# Altium schematic sheet FPGA_USB.SchDoc
size A3; SheetNumber: 7; SheetTotal: 9
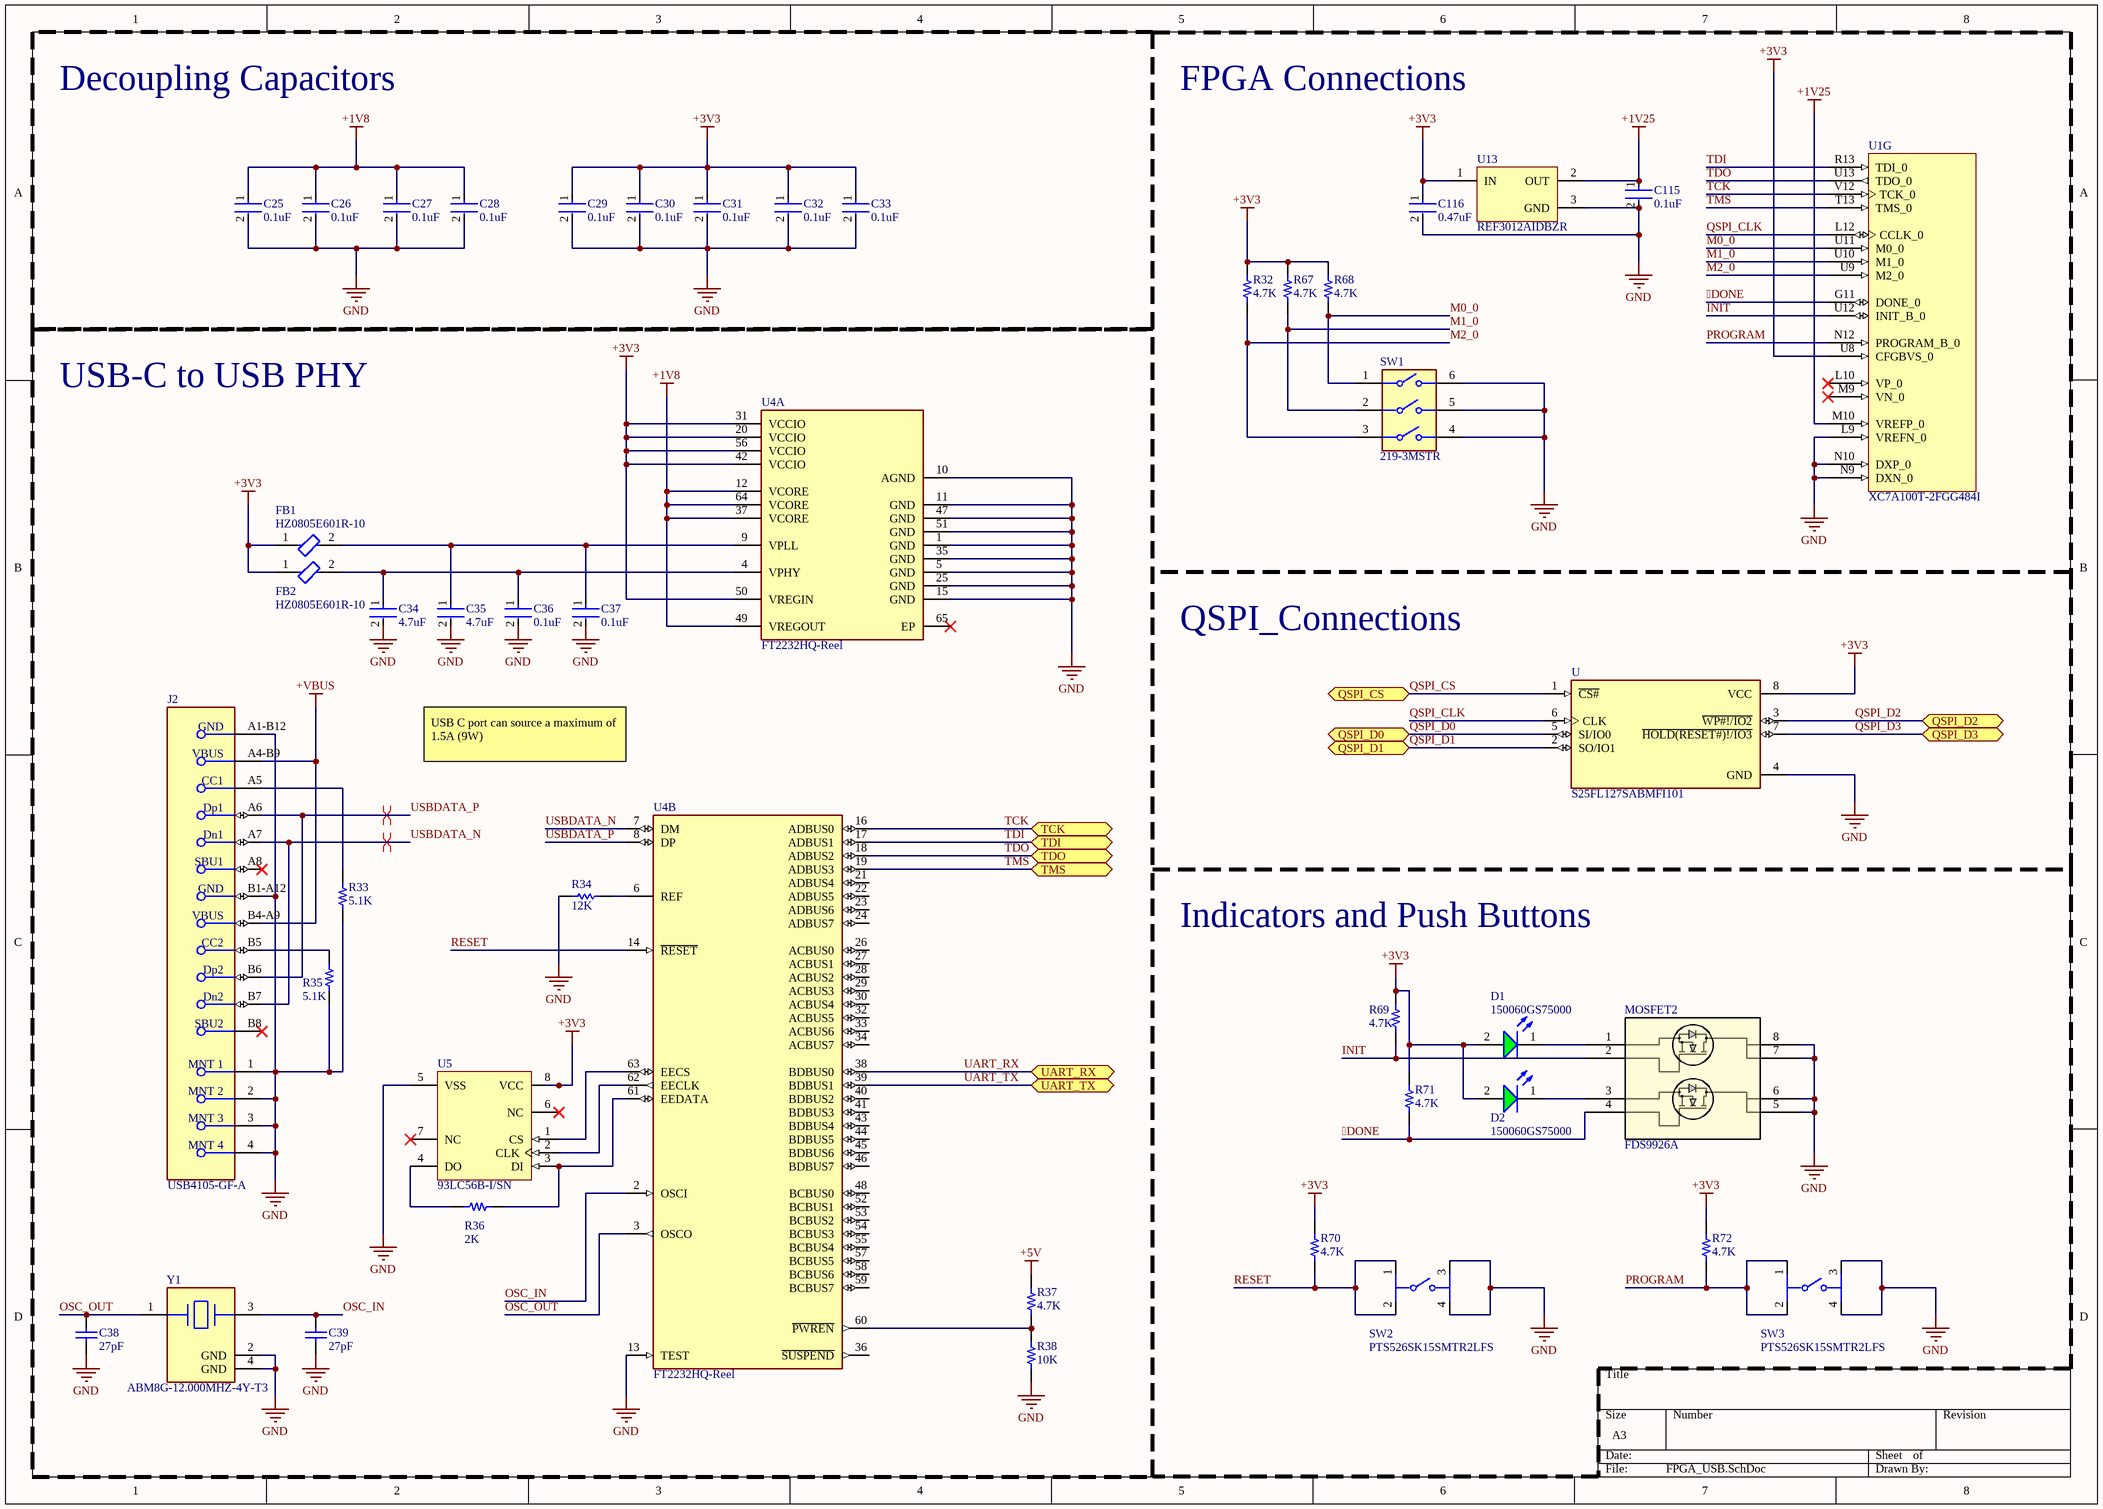
[diagram p0: FPGA_USB.SchDoc]

## Parts
C25  0.1uF  [FP-CC0402-MFG]
C26  0.1uF  [FP-CC0402-MFG]
C27  0.1uF  [FP-CC0402-MFG]
C28  0.1uF  [FP-CC0402-MFG]
C29  0.1uF  [FP-CC0402-MFG]
C30  0.1uF  [FP-CC0402-MFG]
C31  0.1uF  [FP-CC0402-MFG]
C32  0.1uF  [FP-CC0402-MFG]
C33  0.1uF  [FP-CC0402-MFG]
C34  4.7uF  [FP-CC0402-MFG]
C35  4.7uF  [FP-CC0402-MFG]
C36  0.1uF  [FP-CC0402-MFG]
C37  0.1uF  [FP-CC0402-MFG]
C38  27pF  [CAPC1005X55X25LL05T10]
C39  27pF  [CAPC1005X55X25LL05T10]
C115  0.1uF  [FP-CC0402-MFG]
C116  0.47uF  [FP-GRM188-0_1-e0_2_0_5-MFG]
D1  150060GS75000  [WL-SMCW_0603_150060xx75000]
D2  150060GS75000  [WL-SMCW_0603_150060xx75000]
FB1  HZ0805E601R-10  [FP-HZ0805-MFG]
FB2  HZ0805E601R-10  [FP-HZ0805-MFG]
J2  USB4105-GF-A  [FP-USB4105-GF-A-MFG]
MOSFET2  FDS9926A  [SOIC8_751EB_ONS-M]
R32  4.7K  [RES 0603_1608]
R33  5.1K  [RES 0603_1608]
R34  12K  [RESC1608X55X25NL10T15]
R35  5.1K  [RES 0603_1608]
R36  2K  [RES 0603_1608]
R37  4.7K  [RES 0603_1608]
R38  10K  [RES 0603_1608]
R67  4.7K  [RES 0603_1608]
R68  4.7K  [RES 0603_1608]
R69  4.7K  [RES 0603_1608]
R70  4.7K  [RES 0603_1608]
R71  4.7K  [RES 0603_1608]
R72  4.7K  [RES 0603_1608]
SW1  219-3MSTR  [FP-219-3MSTR-MFG]
SW2  PTS526SK15SMTR2LFS  [FP-PTS526SK15SMTR2LFS-MFG]
SW3  PTS526SK15SMTR2LFS  [FP-PTS526SK15SMTR2LFS-MFG]
U  S25FL127SABMFI101  [SOIC127P800X216-8N]
U1  XC7A100T-2FGG484I  [FGG484]  (part G of 10)
U4  FT2232HQ-Reel  [FP-FT2232HQ-Reel-MFG]  (parts A,B of 2)
U5  93LC56B-I/SN  [SOIC-SN8_L]
U13  REF3012AIDBZR  [DBZ0003A_M]
Y1  ABM8G-12.000MHZ-4Y-T3  [FP-ABM8G-MFG]

## Blocks framed on the sheet
Decoupling Capacitors: C25-C33
USB-C to USB PHY: C34-C39 FB1 FB2 J2 R33-R38 U4 U5 Y1

## Ports
QSPI_CS (bidir), QSPI_D0 (bidir), QSPI_D1 (bidir), QSPI_D2 (bidir), QSPI_D3 (bidir), TCK (bidir), TDI (bidir), TDO (bidir), TMS (bidir), UART_RX (bidir), UART_TX (bidir)

## Nets
+1V8: C25.1 C26.1 C27.1 C28.1 U4.12(VCORE) U4.37(VCORE) U4.49(VREGOUT) U4.64(VCORE)
+1V25: C115.1 U1.M10(VREFP_0) U13.2(OUT)
+3V3: C29.1 C30.1 C31.1 C32.1 C33.1 C116.1 D1.2(A) D2.2(A) FB1.1 FB2.1 R32.2 R67.1 R68.1 R69.1 R70.1 R71.1 R72.1 U.8(VCC) U1.U8(CFGBVS_0) U4.20(VCCIO) U4.31(VCCIO) U4.42(VCCIO) U4.50(VREGIN) U4.56(VCCIO) U5.8(VCC) U13.1(IN)
+5V: R37.1
+VBUS: J2.A4-B9(VBUS) J2.B4-A9(VBUS)
GND: C25.2 C26.2 C27.2 C28.2 C29.2 C30.2 C31.2 C32.2 C33.2 C34.2 C35.2 C36.2 C37.2 C38.2 C39.2 C115.2 C116.2 J2.1(MNT_1) J2.2(MNT_2) J2.3(MNT_3) J2.4(MNT_4) J2.A1-B12(GND) J2.B1-A12(GND) MOSFET2.5 MOSFET2.6 MOSFET2.7 MOSFET2.8 R33.2 R34.1 R35.2 R38.2 SW1.4 SW1.5 SW1.6 SW2.3 SW2.4 SW3.3 SW3.4 U.4(GND) U1.L9(VREFN_0) U1.N9(DXN_0) U1.N10(DXP_0) U4.1(GND) U4.5(GND) U4.10(AGND) U4.11(GND) U4.13(TEST) U4.15(GND) U4.25(GND) U4.35(GND) U4.47(GND) U4.51(GND) U5.5(VSS) U13.3(GND) Y1.2(GND) Y1.4(GND)
DONE: MOSFET2.4 R71.2 U1.G11(DONE_0)
\: J2.A6(Dp1) J2.B6(Dp2) U4.8(DP)  [also labelled USBDATA_P]
INIT: MOSFET2.2 R69.2 U1.U12(INIT_B_0)
M0_0: R68.2 SW1.1 U1.U11(M0_0)
M1_0: R67.2 SW1.2 U1.U10(M1_0)
M2_0: R32.1 SW1.3 U1.U9(M2_0)
OSC_IN: C39.1 U4.2(OSCI) Y1.3
OSC_OUT: C38.1 U4.3(OSCO) Y1.1
PROGRAM: R72.2 SW3.1 SW3.2 U1.N12(PROGRAM_B_0)
QSPI_CLK: U.6(CLK) U1.L12(CCLK_0)
QSPI_CS: U.1(~{CS#}) ; port QSPI_CS
QSPI_D0: U.5(SI/IO0) ; port QSPI_D0
QSPI_D1: U.2(SO/IO1) ; port QSPI_D1
QSPI_D2: U.3(~{WP#!/IO2}) ; port QSPI_D2
QSPI_D3: U.7(~{HOLD(RESET#)!/IO3}) ; port QSPI_D3
RESET: R70.2 SW2.1 SW2.2 U4.14(~{RESET})
TCK: U1.V12(TCK_0) U4.16(ADBUS0) ; port TCK
TDI: U1.R13(TDI_0) U4.17(ADBUS1) ; port TDI
TDO: U1.U13(TDO_0) U4.18(ADBUS2) ; port TDO
TMS: U1.T13(TMS_0) U4.19(ADBUS3) ; port TMS
UART_RX: U4.38(BDBUS0) ; port UART_RX
UART_TX: U4.39(BDBUS1) ; port UART_TX
USBDATA_N: J2.A7(Dn1) J2.B7(Dn2) U4.7(DM)
NetC34_1: C34.1 C36.1 FB2.2 U4.4(VPHY)
NetC35_1: C35.1 C37.1 FB1.2 U4.9(VPLL)
NetD1_1: D1.1(K) MOSFET2.1
NetD2_1: D2.1(K) MOSFET2.3
NetJ2_A5: J2.A5(CC1) R33.1
NetJ2_B5: J2.B5(CC2) R35.1
NetR34_2: R34.2 U4.6(REF)
NetR36_1: R36.1 U5.4(DO)
NetR36_2: R36.2 U4.61(EEDATA) U5.3(DI)
NetR37_2: R37.2 R38.1 U4.60(~{PWREN})
NetU4_62: U4.62(EECLK) U5.2(CLK)
NetU4_63: U4.63(EECS) U5.1(CS)

Not connected (* = marked no-connect by the designer): J2 A8(SBU1)* B8(SBU2)*; U1 L10(VP_0)* M9(VN_0)*; U4 21(ADBUS4) 22(ADBUS5) 23(ADBUS6) 24(ADBUS7) 26(ACBUS0) 27(ACBUS1) 28(ACBUS2) 29(ACBUS3) 30(ACBUS4) 32(ACBUS5) 33(ACBUS6) 34(ACBUS7) 36(~{SUSPEND}) 40(BDBUS2) 41(BDBUS3) 43(BDBUS4) 44(BDBUS5) 45(BDBUS6) 46(BDBUS7) 48(BCBUS0) 52(BCBUS1) 53(BCBUS2) 54(BCBUS3) 55(BCBUS4) 57(BCBUS5) 58(BCBUS6) 59(BCBUS7) 65(EP)*; U5 6(NC)* 7(NC)*

## Layout directives
differential pair: \, USBDATA_N

## Notes on the sheet
- FPGA Connections
- QSPI_Connections
- USB C port can source a maximum of 1.5A (9W)
- Indicators and Push Buttons

## Library data of the parts
C25-C33 C36 C37 C115 = CMP-03422-000048-1: CAP CER 0.1UF 16V X7R 0402; Manufacturer: YAGEO; Manufacturer Part Number: CC0402KRX7R7BB104; Material: Ceramic; Automotive Grade: NA; Capacitance: 100 nF; Temperature Coefficient: 30ppm/°C; Tolerance: 0.1; Value: 100 nF; Device Class L1: Passive Components; Temperature Range Low: -55°C; Device Class L3: Ceramic Capacitors; Temperature Characteristic: X7R; Ipc Land Pattern Name: CAPC10050X50; Temperature Range High: +125°C; Voltage Rating: 16 V; Temperature: -55°C to +125°C; RoHS: TRUE; Automotive: No; Height: 0.55mm; Device Class L2: Capacitors; Digikey Description: CAP CER 0.1UF 16V X7R 0402; Package: CC0402; Footprint Url: http://www.yageo.com/exep/pages/download/literatures/UPY-C_GEN_24.pdf; ComponentLink2Description: Datasheet; Category: Cap; Lead Free: Yes; Octopart: https://octopart.com/cc0402krx7r7bb104-yageo-42244624; ComponentLink2URL: http://www.yageo.com/documents/recent/UPY-GP_NP0_16V-to-50V_16.pdf; Mouser Description: 0402 0.1 uF 16 V ±10 % Tolerance X7R SMT Multilayer Ceramic Capacitor
C34 C35 = CMP-03422-001118-1: CAP CER 4.7UF 10V X5R 0402; Manufacturer Part Number: CC0402MRX5R6BB475; Manufacturer: YAGEO; Automotive Grade: NA; Tolerance: 0.2; Temperature Coefficient: 30ppm/°C; Material: Ceramic; ComponentLink2URL: http://www.yageo.com/documents/recent/UPY-GP_NP0_16V-to-50V_16.pdf; Temperature Range Low: -55°C; Digikey Description: CAP CER 4.7UF 10V X5R 0402; Category: Cap; Height: 0.55mm; Mouser Description: Multilayer Ceramic Capacitors MLCC - SMD/SMT 4.7M nF X5R 20% 10 Volts; ComponentLink2Description: Datasheet; Automotive: No; Octopart: https://octopart.com/cc0402mrx5r6bb475-yageo-57080755; Device Class L3: Ceramic Capacitors; Temperature Characteristic: X5R; Ipc Land Pattern Name: CAPC10050X50; Device Class L1: Passive Components; RoHS: TRUE; Device Class L2: Capacitors; Temperature Range High: +125°C; Voltage Rating: 10 V; Value: 4.7 uF; Footprint Url: http://www.yageo.com/exep/pages/download/literatures/UPY-C_GEN_24.pdf; Capacitance: 4.7 uF; Package: CC0402; Lead Free: Yes; Temperature: -55°C to +125°C
C38 C39 = CMP-2008-03917-1: Part Number: GRM1555C1H270JA01D; Manufacturer: Murata
C116 = CMP-06035-003857-1: Chip Multilayer Ceramic Capacitors for General Purpose, 0603, 0.47uF, X7R, 15%, 10%, 25V; Capacitance: 470nF; Voltage: 50V; Case Code (Imperial): 0603; Mount: Surface Mount; Material: Ceramic; Case/Package: 0603; Thickness: 0.035inch; Tolerance: 10%; Length: 1.6mm; Lead Free: Lead Free; Voltage Rating: 25V; Width: 0.031inch; Voltage Rating (DC): 25V; Dielectric: X7R; Case Code (Metric): 1608; Number of Pins: 2; Termination: SMD/SMT; REACH SVHC: No SVHC; Min Operating Temperature: -55°C; Max Operating Temperature: 125°C; Depth: 0.8mm; Height: 0.8mm; Package Quantity: 4000; Packaging: Tape and Reel
D1 D2 = CMP-1426-00002-3: NexarPartId: 29687084; Color: Green; Power Dissipation: 105mW; Peak Wavelength: 515nm; Viewing Angle: 140°; Test Current: 20mA; Wavelength: 520nm; Lens Style: Clear, Rectangular; Max Junction Temperature (Tj): 95°C; Luminous Intensity: 430mcd; Output Current: 10µA; Max Reverse Voltage (DC): 5V; Forward Voltage: 3.2V; Dominant Wavelength: 525nm; Forward Current: 100mA; Mount: Surface Mount; Height: 700µm; Lead Free: Lead Free; Min Operating Temperature: -40°C; Max Operating Temperature: 85°C; Length: 1.6mm; Width: 800µm; Case/Package: 0603; Case Code (Imperial): 0603; Case Code (Metric): 1608; Packaging: Tape and Reel; Reverse Voltage: 5V; REACH SVHC: Unknown; RoHS: Compliant
FB1 FB2 = CMP-2000-05194-2: FERRITE BEAD 600 OHM 0805 1LN; Current Rating: 500mA; Frequency: 100MHz; DC Resistance (DCR): 300mR; Number of Lines: 1; Impedance: 600R; Packaging: Tape and Reel; Mount: Surface Mount; Package Quantity: 1; Material: Ferrite; Width: 0.049inch; Min Operating Temperature: -40°C; Core Material: Ferrite; Max Current Rating: 500mA; Case Code (Metric): 2012; Depth: 1.45mm; Case Code (Imperial): 0805; Termination: SMD/SMT; Contact Plating: Tin; Lead Free: Lead Free; Weight: 0.00392oz; Case/Package: 0805; Test Frequency: 100MHz; Length: 2mm; Height: 1.25mm; Max Operating Temperature: 125°C; Max DC Current: 500mA
J2 = CMP-245163-000001-1: CONN RCPT USB2.0 TYPEC 5A; Manufacturer: GCT; Voltage Rating: 20V; Is Female: yes; Current Rating: 5/6.25/1.25/0.25A; Number Of Contacts: 16; Conn Orientation: Right Angle; Device Class L1: Connectors; Category: Conn; Lead Free: Yes; RoHS: TRUE; Temperature Range High: +85°C; Digikey Description: CONN RCPT USB2.0 TYPEC 5A; Device Class L3: unset; ComponentLink2Description: Datasheet; Manufacturer Part Number: USB4105-GF-A; Package: 0; Usb Standard: USB 2.0; Device Class L2: USB Connectors; Automotive: No; Temperature Range Low: -40°C; Height: 3.46mm; Temperature: -40°C to +85°C; Contact Material: Gold,Nickel; ComponentLink2URL: https://gct.co/files/drawings/usb4105.pdf; Octopart: https://octopart.com/usb4105-gf-a-gct-106627878
MOSFET2 = FDS9926A: No Description Available; Mfr_Name: onsemi; RefDes: RefDes; Type: Type
R32 R37 R67-R72 = CMP-010-0075-8: Fixed Resistor, Metal Glaze/thick Film, 0.1W, 4700ohm, 75V, 1% +/-Tol, 100ppm/Cel, Surface Mount, 0603; Temperature Coefficient: 100ppm/°C; Case/Package: 0603; Voltage Rating: 75V
R33 R35 = CMP-00051-2: 5.1 kOhms ±1% 0.1W, 1/10W Chip Resistor 0603 (1608 Metric) Automotive AEC-Q200 Thick Film; Voltage Rating: 75V; Temperature Coefficient: 100ppm/°C; Case/Package: 0603
R34 = CMP-1659-00047-2: Chip Resistor, 12 KOhm, +/- 1%, 100 mW, -55 to 155 degC, 0603 (1608 Metric), RoHS, Tape and Reel; Resistance: 12 kohm; Power Rating: 100 mW; Voltage Rating (DC): 50 V; Case\Package: 0603; ComponentLink2URL: http://www.yageo.com/documents/recent/PYu-RC_Group_51_RoHS_L_04.pdf; Case Code (Imperial): 0603; ComponentLink2Description: Datasheet; Height: 0.45 mm; Case Code (Metric): 1608; RoHSCompliant: true; Max Operating Temperature: 155 degC; Width: 0.8 mm; Mount: Surface Mount; ComponentLink1URL: http://www.yageo.com/; Pins: 2; Tolerance: 1%; Min Operating Temperature: -55 degC; Length: 1.6 mm; PackageReference: 0603; REACH SVHC: No SVHC; PackageDescription: 2-Pin Surface Mount Device, Body 1.6 x 0.8 mm; Voltage Rating: 50 V; Packaging: Tape and Reel; Package Quantity: 5000; ComponentLink1Description: Manufacturer URL; DatasheetVersion: Rev. 4, 02/2016
R36 = CMP-010-0057-8: 2k Ohm ±1% 0.1W, 1/10W Chip Resistor 0603 (1608 Metric) Moisture Resistant Thick Film; Voltage Rating: 75V; Temperature Coefficient: 100ppm/°C; Case/Package: 0603
R38 = CMP-009-00190-14: 10 ±1% 0.1W, 1/10W Chip Resistor 0603 (1608 Metric) Automotive AEC-Q200 Thick Film; Voltage Rating: 75V; Temperature Coefficient: 100ppm/°C; Case/Package: 0603
SW1 = CMP-07018-000004-1: SWITCH SLIDE DIP SPST 100MA 20V; Washable: Yes; Mechanical Life: 2000Cycles; Number of Positions: 3; Pitch: 0.1inch; Actuator Type: Slide (Standard); Max Operating Temperature: 85°C; Voltage Rating (DC): 20V; Termination: Gull Wing; Length: 0.358inch; Min Operating Temperature: -55°C; Orientation: Straight; Mount: Surface Mount; Package Quantity: 1000; Current Rating: 100mA; Electrical Life: 2000Cycles; Max Current Rating: 100mA; Throw Configuration: SPST; Contact Material: Copper; Packaging: Tape and Reel; Contact Plating: Gold; Lead Free: Lead Free; Max Voltage Rating (DC): 20V
SW2 SW3 = CMP-10040-000013-1: TACT 5.2 X 5.2, 1.5 MM H, 260GF,; Manufacturer: C&K; Operating Force: 250gf; Throw Configuration: SPST-NO; Contact Current Rating: 50mA; Standoff Height: 0mm; Contact Resistance: 100mΩ; Voltage Rating Dc: 12V; Electromechanical Life: 200000Cycles; Device Class L3: Tactile Switches; Device Class L2: Switches; Temperature: -20°C to +70°C; Temperature Range Low: -20°C; Package: PTS526SK15SMTR2LFS; Temperature Range High: +70°C; ComponentLink2Description: Datasheet; Device Class L1: Electromechanical; Height: 1.65mm; Digikey Description: TACT 5.2 X 5.2, 1.5 MM H, 260GF,; Category: Switch; RoHS: TRUE; Automotive: No; Lead Free: Yes; Manufacturer Part Number: PTS526SK15SMTR2LFS; Octopart: https://octopart.com/pts526+sk15+smtr2+lfs-c%26k+components-100617999; ComponentLink2URL: https://www.ckswitches.com/media/2780/pts526.pdf
U = S25FL127SABMFI101: FLASH - NOR Memory IC 128Mb _16M x 8_ SPI - Quad I/O 108MHz 8-SOIC; MF: Cypress Semiconductor; SnapEDA_Link: https://www.snapeda.com/parts/S25FL127SABMFI101/Teledyne%20e2v/view-part/580625/?ref=snap; Value: *; Digi-Key_Part_Number: 1274-1045-ND; Digi-Key_Purchase_URL: https://www.digikey.com/product-detail/en/cypress-semiconductor-corp/S25FL127SABMFI101/1274-1045-ND/4142071?utm_source=snapeda&utm_medium=aggregator&utm_campaign=symbol; MP: S25FL127SABMFI101; Package: SOIC-8 Cypress Semiconductor
U1 = CMP-0364-00030-3: Artix-7 FPGA, 285 User I/Os, 4 GTP, 484-Ball BGA, Speed Grade 2, Industrial Grade, Pb-Free; Manufacturer: Xilinx; DSP48E1 Slices: 240; Speed Grade: -2; Clock Mgmt Tiles (CMTs): 6; Block RAM Blocks (Max Kb): 4860; Max User I/O: 300; Block RAM Blocks (18Kb): 270; CLBs (Slices): 15850; Logic Cells: 101440; Block RAM Blocks (36Kb): 135; ComponentLink2URL: http://www.xilinx.com/support/documentation/user_guides/ug475_7Series_Pkg_Pinout.pdf; DatasheetVersion: v1.12; PartNumber: XC7A100T-2FGG484I; ComponentLink5Description: Packaging and Pinout; PackageDescription: Wire-Bond Fine-Pitch BGA, Body 23 x 23 mm, 1.0 mm Pitch; Mounting Technology: Surface Mount; ComponentLink1Description: Datasheet; ComponentLink4URL: http://www.xilinx.com/support/packagefiles/a7packages/xc7a100tfgg484pkg.txt; PackageVersion: Rev 1.8; NexusDeviceID: XC7A100T-2FGG484I; ComponentLink5URL: http://www.xilinx.com/support/documentation/user_guides/ug475_7Series_Pkg_Pinout.pdf; Code_JEDEC: MS-034-AAJ-1; Generic Part Number: XC7A100T; ComponentLink4Description: Package File; ComponentLink3Description: DC and Switching Characteristics; ComponentLink1URL: http://www.xilinx.com/support/documentation/data_sheets/ds180_7Series_Overview.pdf; CLBs (Max Distributed RAM Kb): 1188; ComponentLink2Description: Package Specification; RoHS: Pb-Free; ComponentLink3URL: http://www.xilinx.com/support/documentation/data_sheets/ds181_Artix_7_Data_Sheet.pdf; PackageReference: FGG484
U4 = CMP-0078-00004-5: IC USB HS DUAL UART/FIFO 64-QFN; Manufacturer: FTDI; Min Supply Voltage: 1.62V; Ciiva Ids: 1315829; Nominal Supply Current: 5-70mA; Standoff Height: 0mm; Import Ts: 1521843541; Description: USB Bridge, USB to UART,FIFO USB 2.0 UART Interface 64-QFN (9x9); Number Of Ports: 1; Max Supply Voltage: 3.63V; Data Rate: 480Mbits/s; Interface: I2C,SPI,UART,USB,RS-232,RS-485,RS-422,Other; Usb Standard: USB 2.0; Octopart: https://octopart.com/ft2232hq-reel-ftdi-19172126; Ipc Land Pattern Name: QFN50P900X900X85-64; Ambient Temperature Range High: +85°C; RoHS: TRUE; Manufacturer Part Number: FT2232HQ-Reel; Automotive: No; Footprint Url: https://www.ftdichip.com/Support/Documents/TechnicalNotes/TN_166%20FTDI%20Example%20IC%20PCB%20Footprints.pdf; Temperature Range High: +85°C; ComponentLink2Description: Datasheet; Ambient Temperature Range Low: -40°C; Mouser Description: USB Interface IC USB HS to Dual UART/ FIFO/SPI/JTAG/I2C; ComponentLink2URL: https://www.ftdichip.com/Support/Documents/DataSheets/ICs/DS_FT2232H.pdf; Digikey Description: IC USB HS DUAL UART/FIFO 64-QFN; Release Date: 1383921489; Height: 0.9mm; Lead Free: Yes; Package: QFN64; Device Class L1: Integrated Circuits (ICs); Temperature: -40°C to +85°C; Temperature Range Low: -40°C; Category: IC; Device Class L2: Interface ICs; Device Class L3: USB Interface ICs
U5 = CMP-0162-00077-1: 2K, 128x16-bit, 2.5V Microwire Serial EEPROM, 8-Pin SOIC 150mil, Industrial Temperature; Code_IPC: SOIC127P600-8; PackageVersion: revBB, Aug-2009; PackageDescription: 8-Lead Plastic Small Outline (SN) - Narrow, 3.90mm Body [SOIC]; DatasheetVersion: revF, May-2008; PackageReference: SOIC-SN8; Code_JEDEC: MS-012
U13 = CMP-0367-00192-2: 1.25 V, 50 ppm / degC, 50 uA Series (Bandgap) Voltage Reference, -40 to 125 degC, 3-pin SOT-23 (DBZ), Green (RoHS & no Sb/Br); Manufacturer: Texas Instruments; VI(Min)(V): 1.8; Iq(Max)(uA): 50; Rating: Catalog; Temp Coeff(Typ)(ppm/ degree C): 20; VI(Max)(V): 5.5; SubFamily: Series Voltage Reference; VO(V): 1.25; Initial Accuracy @ 25/deg C(%): 0.2; Mounting Technology: Surface Mount; PackageDescription: 3-Pin Plastic Small Outline, Body 2.92 x 1.3 mm, Pitch 0.95 mm; PartNumber: REF3012AIDBZR; ComponentLink3Description: Package Specification; Temp Coeff(Max)(ppm/ degree C): 50; ComponentLink1URL: http://www.ti.com/; PackageVersion: 4203227/B; ComponentLink3URL: http://www.ti.com/litv/pdf/mpds108a; ComponentLink2URL: http://www.ti.com/general/docs/lit/getliterature.tsp?genericPartNumber=REF3012&fileType=pdf; Eco-Plan: Green (RoHS & no Sb/Br); ComponentLink2Description: Datasheet; Code_JEDEC: TO-236; ComponentLink1Description: Manufacturer URL; PackageReference: DBZ0003A; DatasheetVersion: SBVS032F
Y1 = CMP-27762-014577-1: Crystal 12MHz ±30ppm (Tol) ±30ppm (Stability) 10pF FUND 120Ω 4-Pin SMD T/R; ESR (Equivalent Series Resistance): 120R; Height: 0.039inch; Load Capacitance: 10pF; Operating Frequency: 12 MHz; REACH SVHC: No SVHC; Series: ABM8G; Series Resistance: 120R; Width: 0.098inch; Case/Package: CSMD; Min Operating Temperature: -10°C; Frequency: 12MHz; Mount: Surface Mount; Frequency Tolerance: 30ppm; Max Operating Temperature: 60°C; Lead Free: Lead Free; Frequency Stability: 30ppm; Depth: 2.5mm; Number of Pins: 4; Length: 3.2mm; Packaging: Tape and Reel